# Altium schematic sheet 08_CoreBoard.SchDoc
size A3
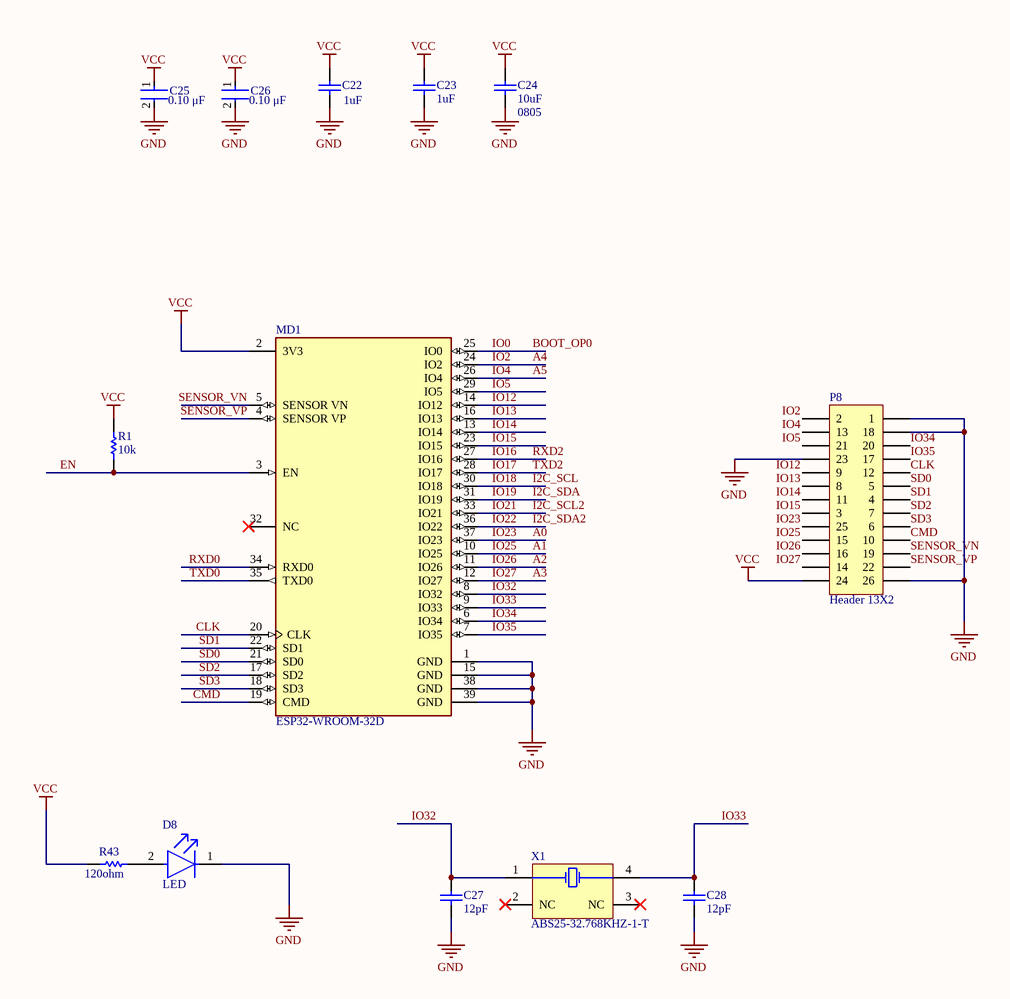
[diagram p0: 08_CoreBoard.SchDoc]

## Parts
C22  value 1uF  [CAPC1608X87X35LL15T15]  (hidden comment: C0603_1UF)
C23  value 1uF  [CAPC1608X87X35LL15T15]  (hidden comment: C0603_1UF)
C24  value 10uF  Package: 0805  [CAPC2013X135X50LL10T20]  (hidden comment: C0805_10UF)
C25  Capacitance: 0.10 μF  [FP-C0603C-CF-MFG]  (hidden comment: C0603_0.1UF)
C26  Capacitance: 0.10 μF  [FP-C0603C-CF-MFG]  (hidden comment: C0603_0.1UF)
C27  value 12pF  [CAPC1608X90X40NL10T20]  (hidden comment: CC0603JRNPO9BN120)
C28  value 12pF  [CAPC1608X90X40NL10T20]  (hidden comment: CC0603JRNPO9BN120)
D8  LED  [FP-LTST-C190GKT-MFG]
MD1  ESP32-WROOM-32D  [FP-ESP32-WROOM-32D-MFG]
P8  Header 13X2  [HDR2X13]
R1  value 10k  [RESC1609X55X30LL15T15]  (hidden comment: R0603_10K)
R43  value 120ohm  [RESC1608X55X30NL20T20]  (hidden comment: R0603_120R)
X1  ABS25-32.768KHZ-1-T  [ABRA-ABS25-4_V]

## Nets
GND: C22.1 C23.1 C24.1 C25.2 C26.2 C27.1 C28.1 D8.1(C) MD1.1(GND) MD1.15(GND) MD1.38(GND) MD1.39(GND) P8.1 P8.18 P8.23 P8.26
VCC: C22.2 C23.2 C24.2 C25.1 C26.1 MD1.2(3V3) P8.24 R1.1 R43.1
A0: MD1.37(IO23) P8.25  [also labelled IO23]
A1: MD1.10(IO25) P8.15  [also labelled IO25]
A2: MD1.11(IO26) P8.16  [also labelled IO26]
A3: MD1.12(IO27) P8.14  [also labelled IO27]
A4: MD1.24(IO2) P8.2  [also labelled IO2]
A5: MD1.26(IO4) P8.13  [also labelled IO4]
BOOT_OP0: MD1.25(IO0)  [also labelled IO0]
CLK: MD1.20(CLK) P8.12
CMD: MD1.19(CMD) P8.10
EN: MD1.3(EN) R1.2
I2C_SCL: MD1.30(IO18)  [also labelled IO18]
I2C_SCL2: MD1.33(IO21)  [also labelled IO21]
I2C_SDA: MD1.31(IO19)  [also labelled IO19]
I2C_SDA2: MD1.36(IO22)  [also labelled IO22]
IO5: MD1.29(IO5) P8.21
IO12: MD1.14(IO12) P8.9
IO13: MD1.16(IO13) P8.8
IO14: MD1.13(IO14) P8.11
IO15: MD1.23(IO15) P8.3
IO16: MD1.27(IO16)  [also labelled RXD2]
IO17: MD1.28(IO17)  [also labelled TXD2]
IO32: C27.2 MD1.8(IO32) X1.1(X1)
IO33: C28.2 MD1.9(IO33) X1.4(X2)
IO34: MD1.6(IO34) P8.20
IO35: MD1.7(IO35) P8.17
RXD0: MD1.34(RXD0)
SD0: MD1.21(SD0) P8.5
SD1: MD1.22(SD1) P8.4
SD2: MD1.17(SD2) P8.7
SD3: MD1.18(SD3) P8.6
SENSOR_VN: MD1.5(SENSOR_VN) P8.19
SENSOR_VP: MD1.4(SENSOR_VP) P8.22
TXD0: MD1.35(TXD0)
NetD8_2: D8.2(A) R43.2

Not connected (* = marked no-connect by the designer): MD1 32(NC)*; X1 2(NC)* 3(NC)*

## Notes on the sheet
- Title
- Size:
- Date:
- A3
- Number:
- Time:
- Revision:
- Sheet
- of
- File:

## Library data of the parts
C22 C23 = CMP-2006-03318-1: Manufacturer: Kemet; Part Number: C0603C101J1GACTU
C24 = CMP-2007-03453-1: Manufacturer: Murata; Part Number: GRM21BR61C106KE15L
C25 C26 = CMP-03020-016578-1: CAP CER 0.1UF 16V X7R 0603; Manufacturer Part Number: C0603C104M4RAC7411; Manufacturer: KEMET; Tolerance: 0.2; Value: 0.10 μF; Automotive Grade: Grade 1; Material: Ceramic; Temperature Coefficient: 30ppm/°C; RoHS: TRUE; Temperature: -55°C to +125°C; Automotive: Yes; Device Class L3: Ceramic Capacitors; Temperature Characteristic: X7R; Package: C0603C-CF; Digikey Description: CAP CER 0.1UF 16V X7R 0603; ComponentLink2URL: https://api.kemet.com/component-edge/download/datasheet/C0603C100J5GACAUTO.pdf; Mouser Description: Multilayer Ceramic Capacitors MLCC - SMD/SMT 16volts 0.1uF X7R 20%; Voltage Rating: 16 V; Temperature Range High: +125°C; Temperature Range Low: -55°C; Height: 0.87mm; Device Class L1: Passive Components; ComponentLink2Description: Datasheet; Lead Free: Yes; Category: Cap; Device Class L2: Capacitors; Octopart: https://octopart.com/c0603c104m4rac7411-kemet-9138805
C27 C28 = CMP-1659-00031-1: Chip Capacitor, 12 pF, +/- 5%, 50 V, -55 to 125 degC, 0603 (1608 Metric), RoHS, Tape and Reel; Tolerance: 1%; Voltage Rating: 250 V; Case\Package: Axial; Power Rating: 250 mW; Resistance: 475 kohm; Mount: Through Hole; Length: 0.248 inch; PackageReference: 0603; DatasheetVersion: Rev. 14, 07/2016; Packaging: Bulk; Max Operating Temperature: 155 degC; Min Operating Temperature: -55 degC; ComponentLink2Description: Datasheet; ComponentLink2URL: http://www.yageo.com/NewPortal/yageodocoutput?fileName=/pdf/MLCC/UPY-GP_NP0_16V-to-50V_14.pdf; ComponentLink1URL: http://www.yageo.com/; PackageDescription: 2-Pin Surface Mount Device, Body 1.6 x 0.8 mm; Package Quantity: 200; RoHSCompliant: true; ComponentLink1Description: Manufacturer URL
D8 = CMP-22017-000005-1: LED GREEN CLEAR CHIP SMD; Reverse Voltage: 5V; Power Dissipation: 100mW; Forward Voltage: 2.1V; Test Current: 10mA; Number of LEDs: 1; Viewing Angle: 130°; Forward Current: 30mA; Voltage: 2V; Wavelength: 565nm; Dominant Wavelength: 569nm; Luminous Intensity: 6mcd; Lens Color: Colorless; Packaging: Tape and Reel; Lens Transparency: Clear; Min Operating Temperature: -55°C; Case Code (Metric): 1608; Lens Style: Clear; Case/Package: 0603; Mount: Surface Mount; Package Quantity: 1; Height: 0.8mm; Illumination Color: Green; Radiation Hardening: No; Depth: 0.8mm; Number of Pins: 2; Max Operating Temperature: 85°C; Color: Green; Number of Elements: 1; Power Rating: 100mW; Case Code (Imperial): 0603; Width: 0.8mm; Length: 1.6mm; Lead Free: Lead Free
MD1 = CMP-194065-000003-1: WIFI MODULE 32MBITS SPI FLASH; Manufacturer: Espressif Systems; Max Supply Voltage: 3.6V; Nominal Supply Current: 500mA; Max Frequency: 2484MHz; Number Of Adc Channels: 16; Number Of Gpio: 32; Interface: I2C,SPI,UART,Ethernet,I2S,Other; Data Rate: 150Mbits/s; Min Supply Voltage: 3V; Bandwidth: 72MHz; Sensitivity: -98dBm; Octopart: https://octopart.com/esp32-wroom-32d-espressif+systems-91040050; Package: ESP32-WROOM-32D; ComponentLink2URL: https://www.espressif.com/sites/default/files/documentation/esp32-wroom-32d_esp32-wroom-32u_datasheet_en.pdf; Lead Free: Yes; Category: UNK; Mouser Description: Wi-Fi/BT BLE Module ESP32-D0WD, SPI Flash, UART, P; Device Class L1: Integrated Circuits (ICs); RoHS: TRUE; Temperature Range Low: -40°C; ComponentLink2Description: Datasheet; Digikey Description: WIFI MODULE 32MBITS SPI FLASH; Height: 3.2mm; Temperature: -40°C to +85°C; Manufacturer Part Number: ESP32-WROOM-32D; Device Class L3: Transceivers; Device Class L2: RF Semiconductors and Devices; Temperature Range High: +85°C; Automotive: No
P8 = Header 13X2: Header, 13-Pin, Dual row; LatestRevisionDate: 17-Jul-2002; LatestRevisionNote: Re-released for DXP Platform.; Publisher: Altium Limited
R1 = CMP-2000-07452-1: Chip Resistor, 10 KOhm, +/- 1%, 0.1 W, -55 to 155 degC, 0603 (1608 Metric), RoHS, Tape and Reel; Manufacturer: Panasonic; Voltage Rating: 75V; Case\/Package: 0603; Power Rating: 100mW; Resistance: 10KOhm; Temperature Coefficient: 100ppm\/degreesC; Number of Pins: 2; Package Reference: 603; Depth: 0.8mm; Mount: SurfaceMount; Package Description: 2-Pin Surface Mount Device, Body 1.6 x 0.85 mm; Datasheet Version: 02/2017; Length: 1.6mm; Lead Free: LeadFree; Height: 0.45mm; Number of Terminations: 2; Max Power Dissipation: 100mW; Min Operating Temperature: -55degC; Datasheet URL: https://industrial.panasonic.com/cdbs/www-data/pdf/RDA0000/AOA0000C304.pdf; Termination: SMD/SMT; Case Code (Metric): 1608; Case Code (Imperial): 0603; Tolerance: 1%; Max Operating Temperature: 155degC; RoHSCompliant: true; Voltage Rating (DC): 75V; Radiation Hardening: No; Packaging: TapeandReel; Composition: ThickFilm; Mounting Technology: SurfaceMount; Manufacturer URL: http://www.panasonic.com/; Width: 0.031inch; REACH SVHC: NoSVHC; Contact Plating: Tin; Military Standard: Not; Package Quantity: 1
R43 = CMP-2000-00896-1: Part Number: ERA-3AEB121V; Manufacturer: Panasonic
X1 = CMP-2000-05736-1: Low Frequency Crystal, 32.768 KHz, -40 to 85 degC, 4-Pin SMD, RoHS, Tape and Reel; Manufacturer: ABRACON; Case Height: 2.5mm; Case Length: 8mm; Case Width: 3.8mm; Load Capacitance: 12.5pF; ESR: 50kOhms; Tolerance: 10PPM; Series: ABS25; Manufacturer URL: http://www.abracon.com/; RoHS: Details; Mounting Style: SMD/SMT; Package Reference: ABS25; Factory Pack Quantity: 3000; Dimensions: 3.8mmWx8mmLx2.5mmH; Package / Case: 8mmx3.8mm; Datasheet URL: http://www.abracon.com/Resonators/abs25.pdf; Termination Style: SMD/SMT; Datasheet Version: 12/2015; Packaging: Reel; Type: LowFrequencyCrystal; Brand: ABRACON; Product Category: Crystals; Operating Temperature Range: -40Cto+85C; Package Description: 4-Pin Surface Mount Device, Body 8 x 3.8 mm, Pitch 5.5 mm; Mounting Technology: SurfaceMount; Frequency: 32.768kHz